# Altium schematic sheet PMP30528_RevB.SchDoc (part 1 of 2)
size 431 x 279 mm; Date: Not shown in title block; ApprovedBy: Not shown in title block; CheckedBy: Not shown in title block; Author: Not shown in title block; CompanyName: Not shown in title block; Engineer: Not shown in title block; Organization: Not shown in title block; Address1: Not shown in title block; Address2: Not shown in title block; Address3: Not shown in title block; Address4: Not shown in title block; DocumentNumber: 1; Revision: Use project parameter SCH_Rev; SheetNumber: 1; SheetTotal: 1; PageSetup: Record=PageOptions|CenterHorizontal=True|CenterVertical=True|PrintScale=1.00|XCorrection=1.00|YCorrection=1.00|PrintKind=0|BorderSize=5000000|LeftOffset=0|BottomOffset=0|Orientation=2|PaperLength=1000|PaperWidth=1000|Scale=100|PaperSource=15|PrintQuality=600|MediaType=1|DitherType=10|PaperKind=Letter|PrintScaleMode=1; CurrentTime: Not shown in title block; CurrentDate: Not shown in title block; Time: Not shown in title block; DocumentFullPathAndName: Not shown in title block; DocumentName: Not shown in title block; ModifiedDate: Not shown in title block; ImagePath: Not shown in title block
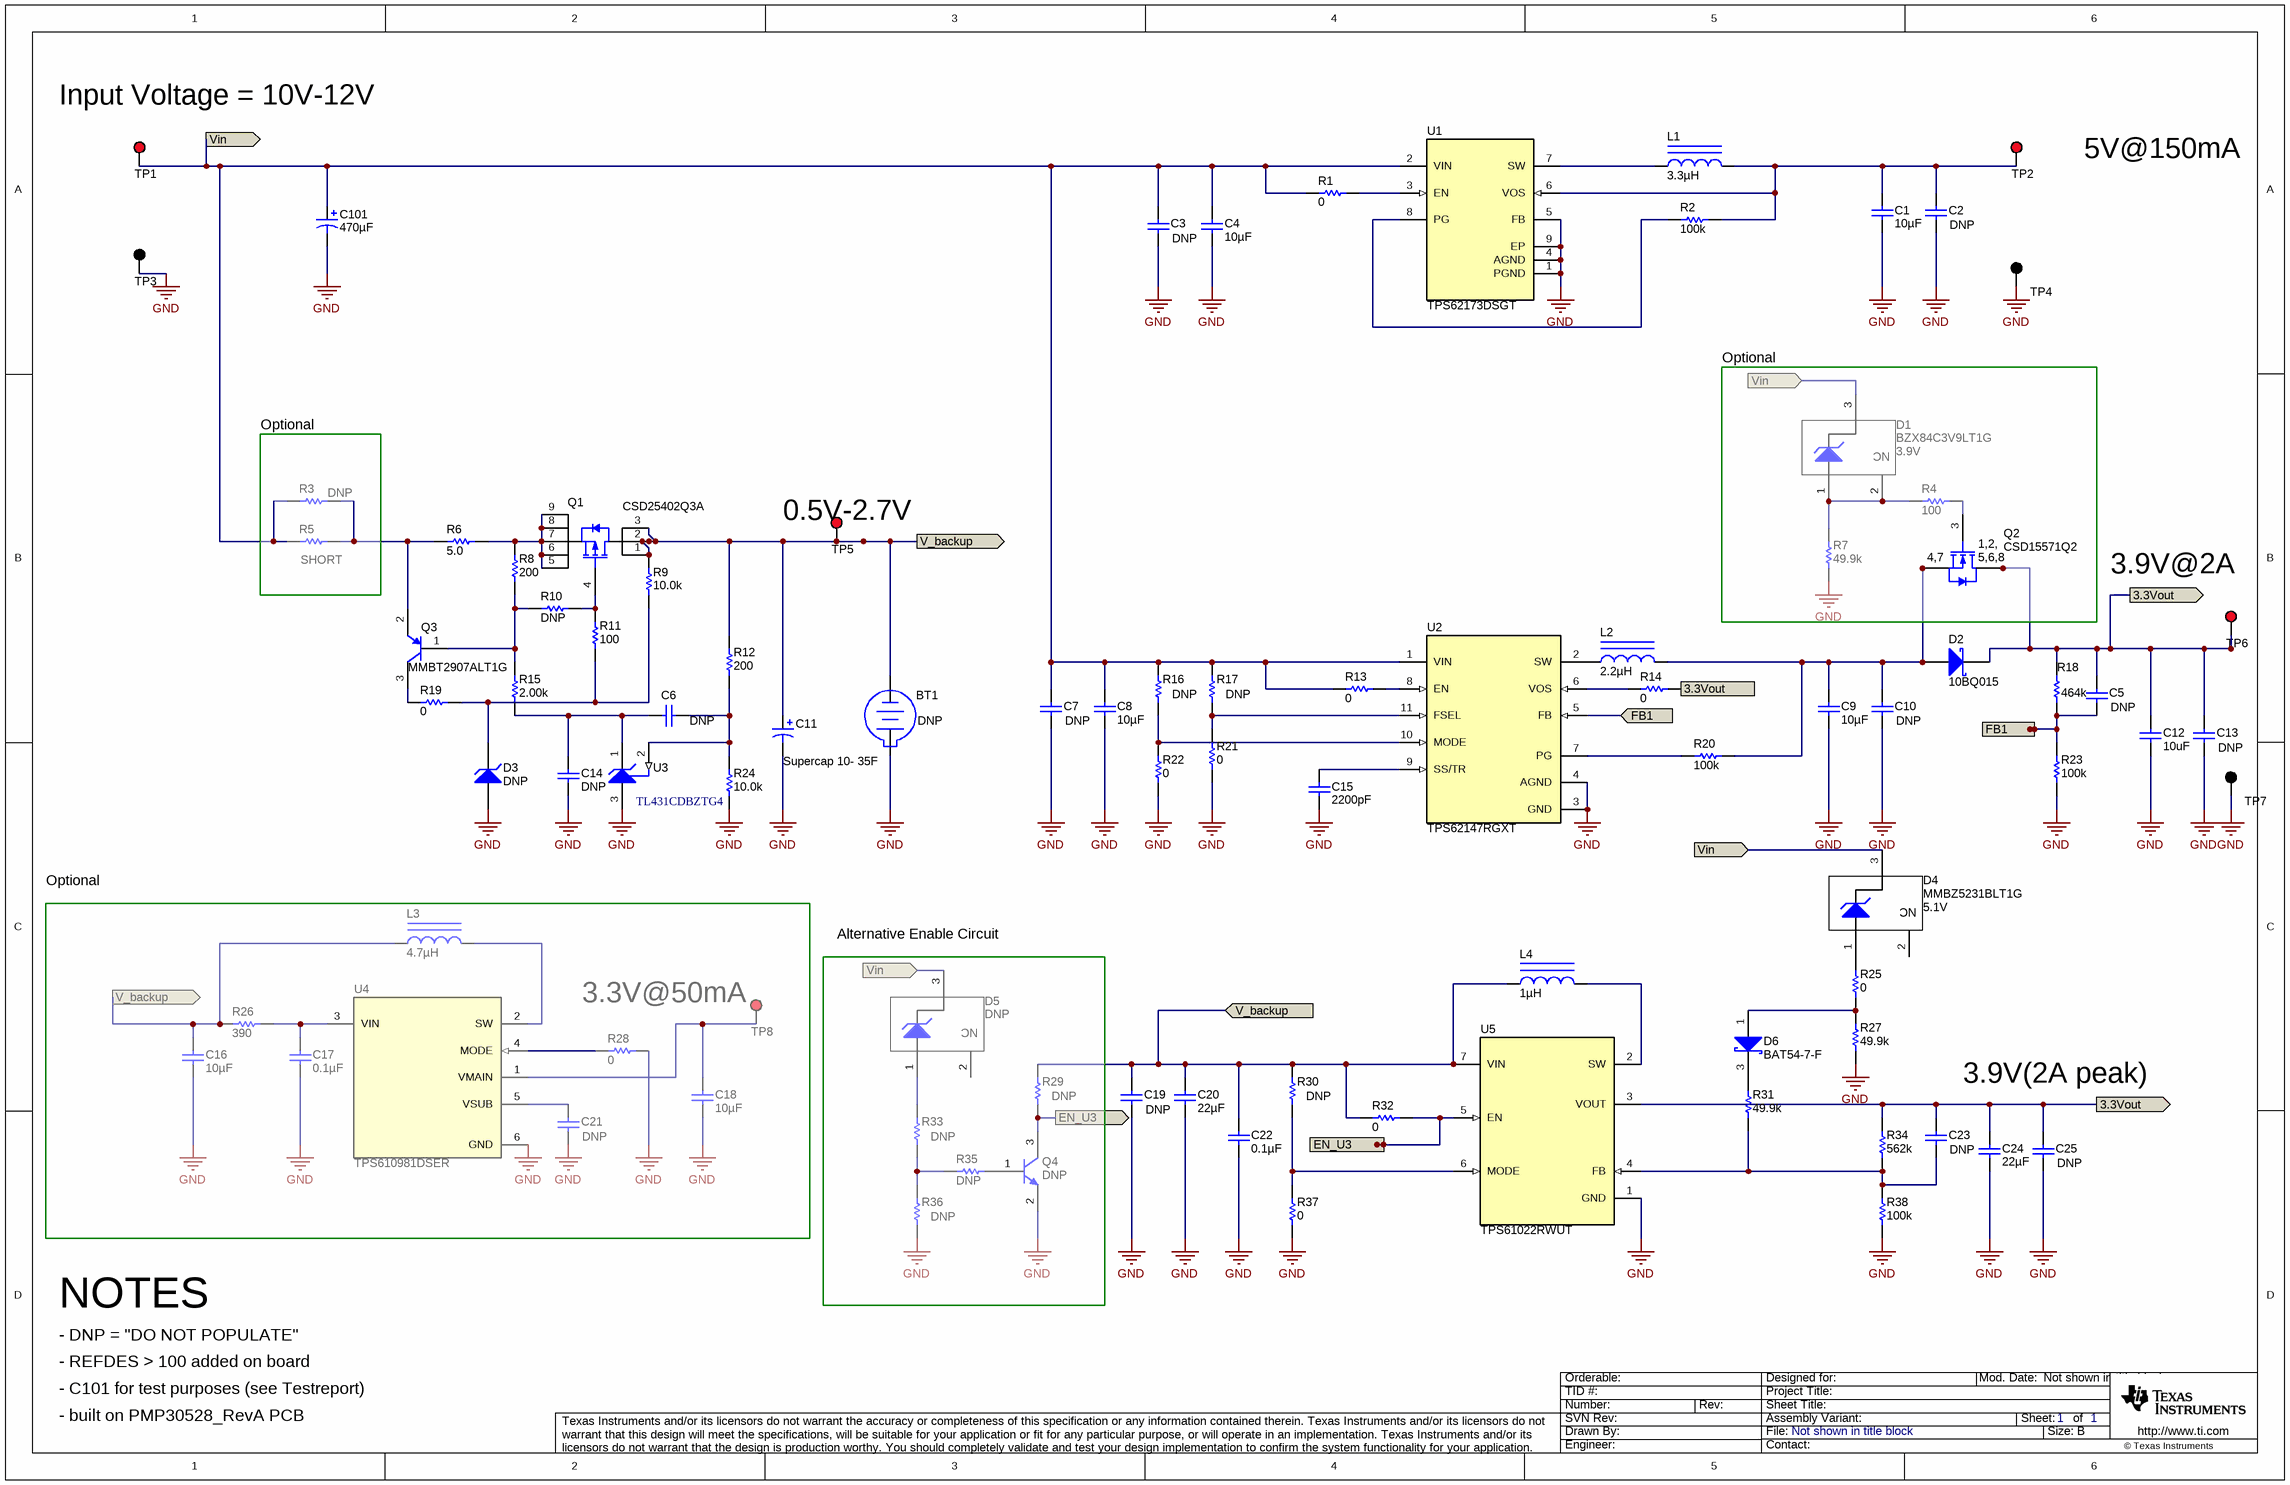
[diagram p0: PMP30528_RevB.SchDoc]

## Parts
BT1  PartNumber: DNP  [MPD_BU2032SM-BT-GTR]  (hidden comment: BU2032SM-BT-GTR)
C1  ValueDisplayed: 10µF  [0805_HV]  (hidden comment: GRM21BR71A106KE51K)
C2  value DNP  [0805]  (hidden comment: Used in BOM report)
C3  value DNP  [0805]  (hidden comment: Used in BOM report)
C4  ValueDisplayed: 10µF  [0805_HV]  (hidden comment: GRM21BZ71E106KE15L)
C5  DNP  [0603]
C6  value DNP  [0805]  (hidden comment: Used in BOM report)
C7  value DNP  [0805]  (hidden comment: Used in BOM report)
C8  ValueDisplayed: 10µF  [0805]  (hidden comment: GRM21BZ71E106KE15L)
C9  ValueDisplayed: 10µF  [1206_180]  (hidden comment: GRM31CR70J106KA01L)
C10  value DNP  [1206]  (hidden comment: Used in BOM report)
C11  PartNumber: Supercap 10- 35F  [HV_1600x2840]  (hidden comment: HV1625-2R7256-R)
C12  value 10uF  [1206]  (hidden comment: C3216X7R1A106K085AC)
C13  PartNumber: DNP  [1206]  (hidden comment: C3216X7R1A106K085AC)
C14  value DNP  [0805]  (hidden comment: Used in BOM report)
C15  ValueDisplayed: 2200pF  [0603]  (hidden comment: C0603X222K5RACTU)
C16  ValueDisplayed: 10µF  [0805_HV]  (hidden comment: GRM21BR70J106KE76L)
C17  ValueDisplayed: 0.1µF  [0805_HV]  (hidden comment: GRM21BR71H104KA01L)
C18  ValueDisplayed: 10µF  [0805_HV]  (hidden comment: GRM21BR70J106KE76L)
C19  value DNP  [0805]  (hidden comment: Used in BOM report)
C20  ValueDisplayed: 22µF  [1206_180]  (hidden comment: GRM31CR70J226KE19L)
C21  value DNP  [0805]  (hidden comment: Used in BOM report)
C22  ValueDisplayed: 0.1µF  [0603]  (hidden comment: GRM188R71H104KA93D)
C23  DNP  [0603]
C24  ValueDisplayed: 22µF  [1206_180]  (hidden comment: GRM31CR71A226ME15L)
C25  value DNP  [1206]  (hidden comment: Used in BOM report)
C101  ValueDisplayed: 470µF  [Chemi-Con_1000x2000]  (hidden comment: EKZE350ELL471MJ20S)
D1  BZX84C3V9LT1G  value 3.9V  [SOT-23]
D2  10BQ015  [SMB]
D3  DNP  [SOD-523]
D4  MMBZ5231BLT1G  value 5.1V  [SOT-23]
D5  DNP  [SOT-23]
D6  BAT54-7-F  [SOT-23]
L1  ValueDisplayed: 3.3µH  [LPS3015]  (hidden comment: LPS3015-332MLB)
L2  ValueDisplayed: 2.2µH  [XFL4020]  (hidden comment: XFL4020-222MEB)
L3  ValueDisplayed: 4.7µH  [VLF302510MT]  (hidden comment: VLF302510MT-4R7M)
L4  ValueDisplayed: 1µH  [XAL6030]  (hidden comment: XAL6030-102MEB)
Q1  CSD25402Q3A  [DNH0008A]
Q2  CSD15571Q2  [DQK0006C]
Q3  MMBT2907ALT1G  [SOT-23]
Q4  DNP  [SOT-23]
R1  ValueDisplayed: 0  [0603]  (hidden comment: CRCW06030000Z0EA)
R2  ValueDisplayed: 100k  [0603]  (hidden comment: CRCW0603100KFKEA)
R3  value DNP  [PNP300]  (hidden comment: PNP300JR-73-47R)
R4  ValueDisplayed: 100  [0805_HV]  (hidden comment: CRCW0805100RFKEA)
R5  SHORT  [PNP300]
R6  ValueDisplayed: 5.0  [1206]  (hidden comment: RC1206FR)
R7  ValueDisplayed: 49.9k  [0805_HV]  (hidden comment: CRCW080549K9FKEA)
R8  ValueDisplayed: 200  [0603]  (hidden comment: CRCW0603200RFKEA)
R9  ValueDisplayed: 10.0k  [0603]  (hidden comment: CRCW060310K0FKEA)
R10  value DNP  [0603]  (hidden comment: Used in BOM report)
R11  ValueDisplayed: 100  [0805_HV]  (hidden comment: CRCW0805100RFKEA)
R12  ValueDisplayed: 200  [0603]  (hidden comment: CRCW0603200RFKEA)
R13  ValueDisplayed: 0  [0603]  (hidden comment: CRCW06030000Z0EA)
R14  ValueDisplayed: 0  [0603]  (hidden comment: CRCW06030000Z0EA)
R15  ValueDisplayed: 2.00k  [0603]  (hidden comment: CRCW06032K00FKEA)
R16  value DNP  [0603_HV]  (hidden comment: Used in BOM report)
R17  value DNP  [0603_HV]  (hidden comment: Used in BOM report)
R18  ValueDisplayed: 464k  [0603]  (hidden comment: CRCW0603464KFKEA)
R19  ValueDisplayed: 0  [0603]  (hidden comment: CRCW06030000Z0EA)
R20  ValueDisplayed: 100k  [0603]  (hidden comment: CRCW0603100KFKEA)
R21  ValueDisplayed: 0  [0603]  (hidden comment: RC0603JR-070RL)
R22  ValueDisplayed: 0  [0603]  (hidden comment: RC0603JR-070RL)
R23  ValueDisplayed: 100k  [0603]  (hidden comment: CRCW0603100KFKEA)
R24  ValueDisplayed: 10.0k  [0603]  (hidden comment: CRCW060310K0FKEA)
R25  ValueDisplayed: 0  [0603]  (hidden comment: CRCW06030000Z0EA)
R26  ValueDisplayed: 390  [0805_HV]  (hidden comment: CRCW0805390RJNEA)
R27  ValueDisplayed: 49.9k  [0805_HV]  (hidden comment: CRCW080549K9FKEA)
R28  ValueDisplayed: 0  [0603]  (hidden comment: CRCW06030000Z0EA)
R29  value DNP  [0603]  (hidden comment: Used in BOM report)
R30  value DNP  [0603]  (hidden comment: Used in BOM report)
R31  ValueDisplayed: 49.9k  [0805_HV]  (hidden comment: CRCW080549K9FKEA)
R32  ValueDisplayed: 0  [0603]  (hidden comment: CRCW06030000Z0EA)
R33  value DNP  [0603]  (hidden comment: Used in BOM report)
R34  ValueDisplayed: 562k  [0603]  (hidden comment: CRCW0603562KFKEA)
R35  value DNP  [0603]  (hidden comment: Used in BOM report)
R36  value DNP  [0603]  (hidden comment: Used in BOM report)
R37  ValueDisplayed: 0  [0603]  (hidden comment: CRCW06030000Z0EA)
R38  ValueDisplayed: 100k  [0603]  (hidden comment: CRCW0603100KFKEA)
TP1  5000  [Keystone5000]  (value not drawn)
TP2  5000  [Keystone5000]  (value not drawn)
TP3  5001  [Keystone5001]  (value not drawn)
TP4  5001  [Keystone5001]  (value not drawn)
TP5  5000  [Keystone5000]  (value not drawn)
TP6  5000  [Keystone5000]  (value not drawn)
TP7  5001  [Keystone5001]  (value not drawn)
TP8  5000  [Keystone5000]  (value not drawn)
U1  TPS62173DSGT  [DSG0008A]
U2  TPS62147RGXT  [RGX0011A]
U3  TL431CDBZTG4  [DBZ0003A_N]
U4  TPS610981DSER  [DSE0006A]
U5  TPS61022RWUT  [RWU0007A]

## Blocks framed on the sheet
Optional: D1 Q2 R4 R7
Optional: R3 R5
3.3V@50mA: C16-C18 C21 L3 R26 R28 TP8 U4
Alternative Enable Circuit: D5 Q4 R29 R33 R35 R36

## Ports
3.3Vout (in), 3.3Vout (out), EN_U3 (in), EN_U3 (out), FB1 (in), FB1 (out), V_backup (in), V_backup (out), Vin (in), Vin (out)

## Nets
GND: BT1.1(+) C1.2 C2.2 C3.2 C4.2 C7.2 C8.2 C9.2 C10.2 C11.2(-) C12.2 C13.2 C14.2 C15.2 C16.2 C17.2 C18.2 C19.2 C20.2 C21.2 C22.2 C24.2 C25.2 C101.2(-) D3.2(A) Q4.2(E) R7.1 R21.1 R22.1 R23.1 R24.1 R27.1 R28.2 R36.1 R37.1 R38.1 TP3.1 TP4.1 TP7.1 U1.1(PGND) U1.4(AGND) U1.5(FB) U1.9(EP) U2.3(GND) U2.4(AGND) U3.3(ANODE) U4.6(GND) U5.1(GND)
3.3Vout: C5.1 C12.1 C13.1 C23.1 C24.1 C25.1 D2.1(K) Q2.1(D) Q2.2(D) Q2.5(D) Q2.6(D) Q2.8(D) R14.2 R18.2 R34.2 TP6.1 U5.3(VOUT) ; port 3.3Vout
EN_U3: Q4.3(C) R29.1 R32.2 U5.5(EN) ; port EN_U3
FB1: C5.2 R18.1 R23.2 U2.5(FB) ; port FB1
V_backup: BT1.2(-) C11.1(+) C16.1 C19.1 C20.1 C22.1 L3.1 L4.1 Q1.1(D) Q1.2(D) Q1.3(D) R9.2 R12.2 R26.1 R29.2 R30.2 R32.1 TP5.1 U5.7(VIN) ; port V_backup
Vin: C3.1 C4.1 C7.1 C8.1 C101.1(+) D1.3(K) D4.3(K) D5.3(K) R1.1 R3.1 R5.1 R13.1 R16.2 R17.2 TP1.1 U1.2(VIN) U2.1(VIN) ; port Vin
NetC1_1: C1.1 C2.1 L1.2 R2.2 TP2.1 U1.6(VOS)
NetC6_1: C6.1 R12.1 R24.2 U3.2(REF)
NetC6_2: C6.2 C14.1 R15.1 U3.1(CATHODE)
NetC9_1: C9.1 C10.1 D2.2(A) L2.2 Q2.4(S) Q2.7(S) R20.2
NetC15_1: C15.1 U2.9(SS/TR)
NetC17_1: C17.1 R26.2 U4.3(VIN)
NetC18_1: C18.1 TP8.1 U4.1(VMAIN)
NetC21_1: C21.1 U4.5(VSUB)
NetC23_2: C23.2 R31.2 R34.1 R38.2 U5.4(FB)
NetD1_1: D1.1(A) D1.2(NC) R4.1 R7.2
NetD3_1: D3.1(K) R9.1 R11.1 R19.2
NetD4_1: D4.1(A) R25.2
NetD5_1: D5.1(A) R33.2
NetD6_1: D6.1(A) R25.1 R27.2
NetD6_3: D6.3(K) R31.1
NetL1_1: L1.1 U1.7(SW)
NetL2_1: L2.1 U2.2(SW)
NetL3_2: L3.2 U4.2(SW)
NetL4_2: L4.2 U5.2(SW)
NetQ1_4: Q1.4(G) R10.1 R11.2
NetQ1_5: Q1.5(S) Q1.6(S) Q1.7(S) Q1.8(S) Q1.9(S) R6.2 R8.2
NetQ2_3: Q2.3(G) R4.2
NetQ3_1: Q3.1(B) R8.1 R10.2 R15.2
NetQ3_2: Q3.2(E) R3.2 R5.2 R6.1
NetQ3_3: Q3.3(C) R19.1
NetQ4_1: Q4.1(B) R35.1
NetR1_2: R1.2 U1.3(EN)
NetR2_1: R2.1 U1.8(PG)
NetR13_2: R13.2 U2.8(EN)
NetR14_1: R14.1 U2.6(VOS)
NetR16_1: R16.1 R22.2 U2.10(MODE)
NetR17_1: R17.1 R21.2 U2.11(FSEL)
NetR20_1: R20.1 U2.7(PG)
NetR28_1: R28.1 U4.4(MODE)
NetR30_1: R30.1 R37.2 U5.6(MODE)
NetR33_1: R33.1 R35.2 R36.2

Not connected (* = marked no-connect by the designer): D4 2(NC); D5 2(NC)

## Notes on the sheet
- (near TP1) Input Voltage = 10V-12V
- 5V@150mA
- (near TP5) 0.5V-2.7V
- (near TP6) 3.9V@2A
- Optional
- 3.9V(2A peak)
- NOTES
- - DNP = "DO NOT POPULATE"
- - REFDES > 100 added on board
- - built on PMP30528_RevA PCB
- - C101 for test purposes (see Testreport)
- Drawn By:
- SVN Rev:
- Number:
- TID #:
- Orderable:
- Rev:
- Sheet Title:
- File:
- Project Title:
- Designed for:
- Assembly Variant:
- Mod. Date:
- Sheet:
- Size:
- of
- B
- http://www.ti.com
- Texas Instruments and/or its licensors do not warrant the accuracy or completeness of this specification or any information contained therein. Texas Instruments and/or its licensors do not warrant that this design will meet the specifications, will be suitable for your application or fit for any particular purpose, or will operate in an implementation. Texas Instruments and/or its licensors do not warrant that the design is production worthy. You should completely validate and test your design implementation to confirm the system functionality for your application.
- Engineer:
- Contact:
- © Texas Instruments
- (in symbol CMP-0000207-1) 1,2,; 4,7; 5,6,8